# EAGLE schematic big_picture (EAGLE 9.1.3)
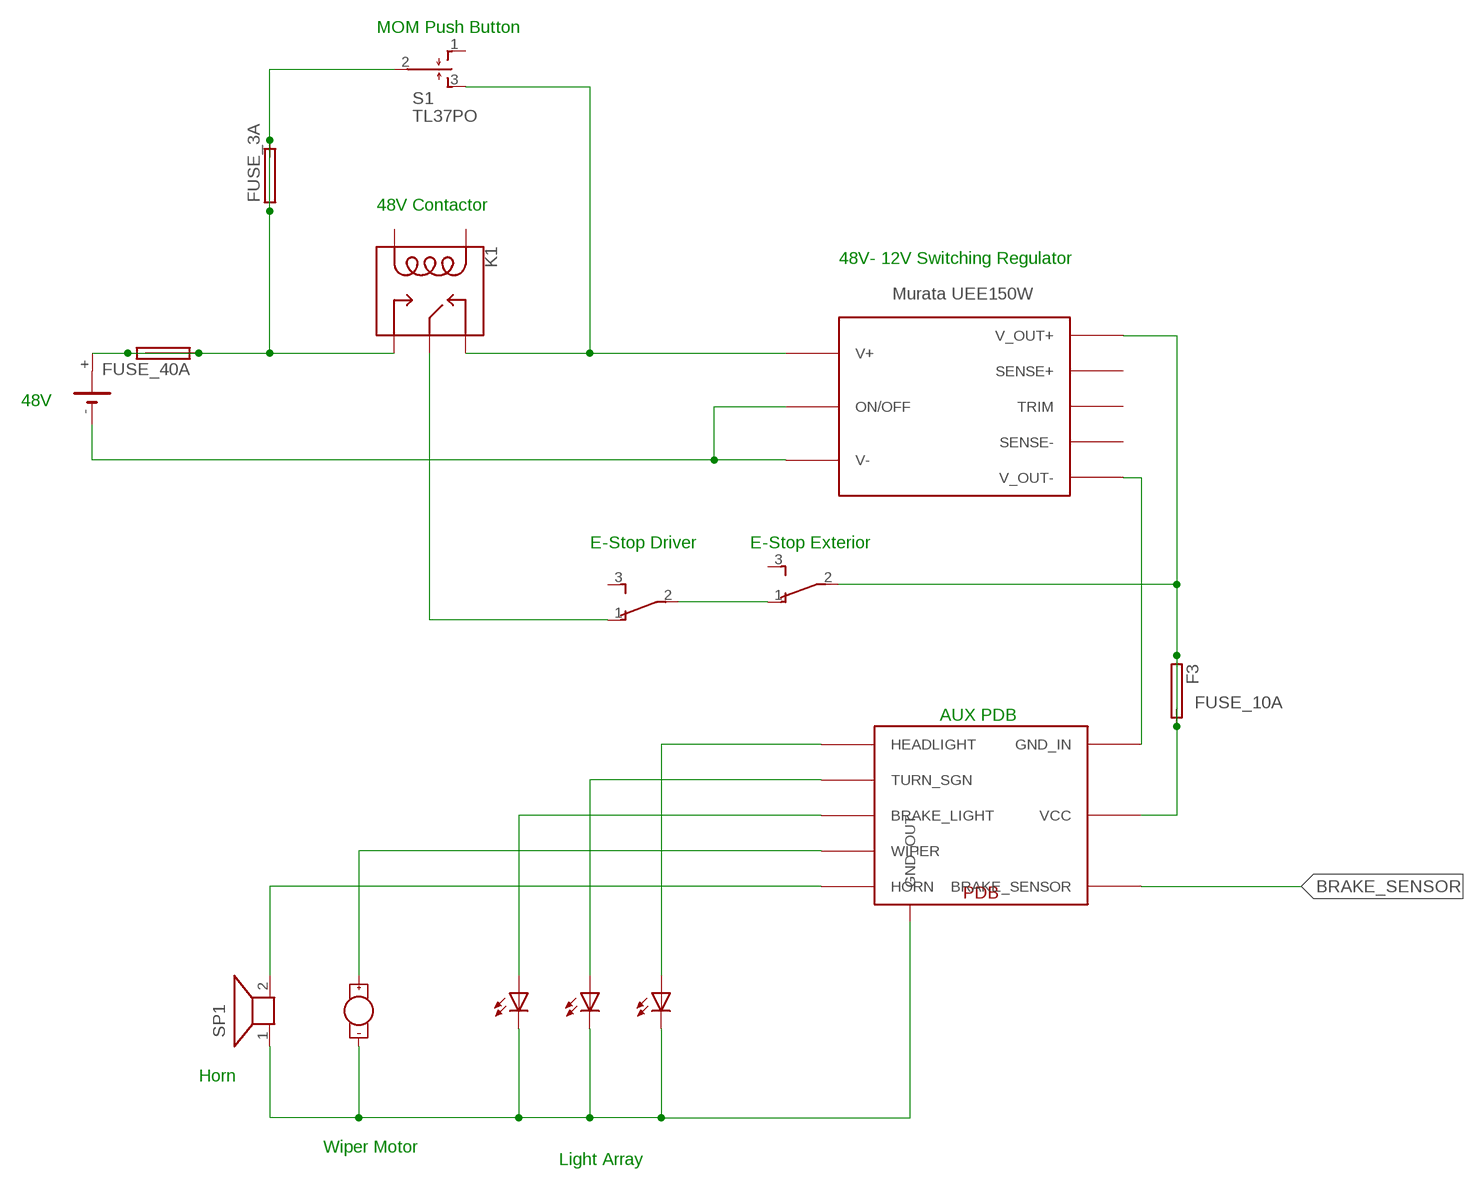
[diagram p0: schematic, sheet 1]

## Parts
DZ1  LZR184  [LZR184]
E_STOP  TL36WO  [TL3XWO]
E_STOP1  TL36WO  [TL3XWO]
F3  FUSESH22,5A  [SH22,5A]
FUSE_3A  FUSESH22,5A  [SH22,5A]
FUSE_40A  FUSESH22,5A  [SH22,5A]
G1  CR1/2  [CR1/2]
K1  RELAY-SPDT-JZC-11F  [RELAY-JZC]
M1  MOTOR10MM  [VIBE-MOTOR-10MM]
S1  TL37PO  [TL3XPO]
SP1  AL30P  [AL30P]
U$4  UEE150W  (no package)
U$5  PDB_OUTLINE  (no package)

## Nets
BRAKE_SENSOR: U$5.BRAKE_SENSOR
FUSE_10A: E_STOP1.2(P) F3.1 F3.2 U$4.V_OUT+ U$5.VCC
N$2: DZ1.A1(-1:A) U$5.BRAKE_LIGHT
N$3: E_STOP1.1(O) E_STOP.2(P)
N$4: G1.- U$4.ON/OFF U$4.V-
N$5: M1.+ U$5.WIPER
N$7: E_STOP.1(O) K1.4(MAIN)
N$8: DZ1.A3(-3:A) U$5.HEADLIGHT
N$9: DZ1.A2(-2:A) U$5.TURN_SGN
N$10: U$4.V_OUT- U$5.GND_IN
N$31: SP1.2 U$5.HORN
N$32: FUSE_3A.1 FUSE_3A.2 FUSE_40A.1 FUSE_40A.2 G1.+ K1.3(NO) S1.2(P)
N$35: K1.2(NC) S1.3(S) U$4.V+
PDB_GND: DZ1.K1(-1:C) DZ1.K2(-2:C) DZ1.K3(-3:C) M1.- SP1.1 U$5.GND_OUT
Unconnected: DZ1.A4(-4:A) DZ1.K4(-4:C) E_STOP1.3(S) E_STOP.3(S) G1.+@1(+) K1.1(COIL2) K1.5(COIL1) S1.1(O) U$4.SENSE+ U$4.SENSE- U$4.TRIM

## Notes on the sheet
- MOM Push Button
- 48V Contactor
- 48V- 12V Switching Regulator
- 48V
- E-Stop Driver | E-Stop Exterior
- AUX PDB
- Horn
- Wiper Motor | Light Array

## Library data of the parts
DZ1 = led:LZR184: LED BLOCK 4 LEDs, Siemens
E_STOP E_STOP1 = switch:TL36WO: TINY SWITCH ON - ON Source: http://www2.produktinfo.conrad.com/datenblaetter/700000-724999/705152-da-01-de-Subminiaturschalter_TL_36WO.pdf
F3 FUSE_3A FUSE_40A = fuse:FUSE: Fuse; OC_FARNELL: unknown; OC_NEWARK: unknown
G1 = battery:CR1/2: LI BATTERY Sonnenschein SL-350 PT
K1 = SparkFun-Electromechanical:RELAY-SPDT: SPDT Electromechanical Relay Single-pole, double-throw sealed relays. When current is applied to the coil, it throws a simple changeover switch, terminating the connection from the NC contact to ground and closing the NO contact. Use them to switch high voltage/high current devices. SparkFun Products JQX-15F: Relay SPDT Sealed - 20A <https://www.sparkfun.com/products/10924> (COM-10924) JZC-11F: Relay SPDT Sealed <https://www.sparkfun.com/products/100> (COM-00100); PROD_ID: COMP-09533; SF_SKU: COM-00100
M1 = SparkFun-Electromechanical:MOTOR: Motor (Single-Phase) Two-terminal, single-phase motors. SparkFun Products Vibration Motor <https://www.sparkfun.com/products/8449> (ROB-08449) Physical dimension and wire connections for this powerful vibration motor. Motor has a self adhesive backing.; PROD_ID: COMP-08572; SF_SKU: ROB-08449
S1 = switch:TL37PO: TINY SWITCH MOM OFF MOM Source: http://www2.produktinfo.conrad.com/datenblaetter/700000-724999/705152-da-01-de-Subminiaturschalter_TL_36YO.pdf
SP1 = buzzer:AL30P: SPEAKER Source: Buerklin; OC_FARNELL: unknown; OC_NEWARK: unknown
U$4 = REV Aux Circuit:UEE150W
U$5 = REV Aux Circuit:PDB_OUTLINE